# EAGLE schematic Power Monitor (EAGLE 9.2.0)
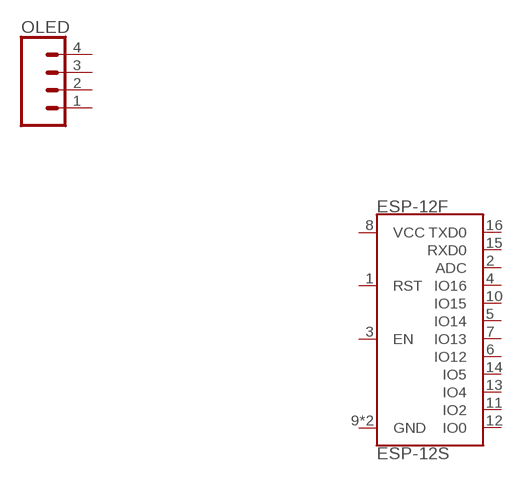
[diagram p0: schematic, sheet 1]

## Parts
ESP-12F  ESP-12S  [ESP-12S]
OLED  CONN_04LOCK  [1X04_LOCK]
Unconnected: ESP-12F.1(RST) ESP-12F.2(ADC) ESP-12F.3(EN) ESP-12F.4(IO16) ESP-12F.5(IO14) ESP-12F.6(IO12) ESP-12F.7(IO13) ESP-12F.8(VCC) ESP-12F.9(GND) ESP-12F.10(IO15) ESP-12F.11(IO2) ESP-12F.12(IO0) ESP-12F.13(IO4) ESP-12F.14(IO5) ESP-12F.15(RXD0) ESP-12F.16(TXD0) ESP-12F.P$1(GND) OLED.1 OLED.2 OLED.3 OLED.4

## Library data of the parts
ESP-12F = SparkFun-RF:ESP-12S: AI-Thinker ESP-12S ESP-12S WiFi module is developed by AI-Thinker Co.,Ltd, core processor ESP8266 in smaller sizes of the module encapsulates Tensilica L106 integrates industry-leading ultra low power 32-bit MCU micro, with the 16-bit short mode, clock speed support 80 MHz, 160 MHz, supports the RTOS, integrated Wi-Fi MAC/BB/RF/PA/LNA, on-board antennas.; PROD_ID: IC-14115
OLED = SparkFun-Connectors:CONN_04: Multi connection point. Often used as Generic Header-pin footprint for 0.1 inch spaced/style header connections On any of the 0.1 inch spaced packages, you can populate with these: Break Away Headers - Straight <https://www.sparkfun.com/products/116> (PRT-00116) Break Away Male Headers - Right Angle <https://www.sparkfun.com/products/553> (PRT-00553) Female Headers <https://www.sparkfun.com/products/115> (PRT-00115) Break Away Headers - Machine Pin <https://www.sparkfun.com/products/117> (PRT-00117) Break Away Female Headers - Swiss Machine Pin <https://www.sparkfun.com/products/743> (PRT-00743) For SCREWTERMINALS and SPRING TERMINALS visit here: Screw Terimnals on SparkFun.com <https://www.sparkfun.com/search/results?term=Screw+Terminals> (5mm/3.5mm/2.54mm spacing) This device is also useful as a general connection point to wire up your design to another part of your project. Our various solder wires solder well into these plated through hole pads. Hook-Up Wire - Assortment (Stranded, 22 AWG) <https://www.sparkfun.com/products/11375> (PRT-11375) Hook-Up Wire - Assortment (Solid Core, 22 AWG) <https://www.sparkfun.com/products/11367> (PRT-11367) View the entire wire category on our website here <https://www.sparkfun.com/categories/141> Special notes: Molex polarized connector foot print use with SKU : PRT-08231 with associated crimp pins and housings. 1MM SMD Version SKU: PRT-10208; PROD_ID: CONN-09696